# Altium schematic sheet STM32最小系统.SchDoc
size A3
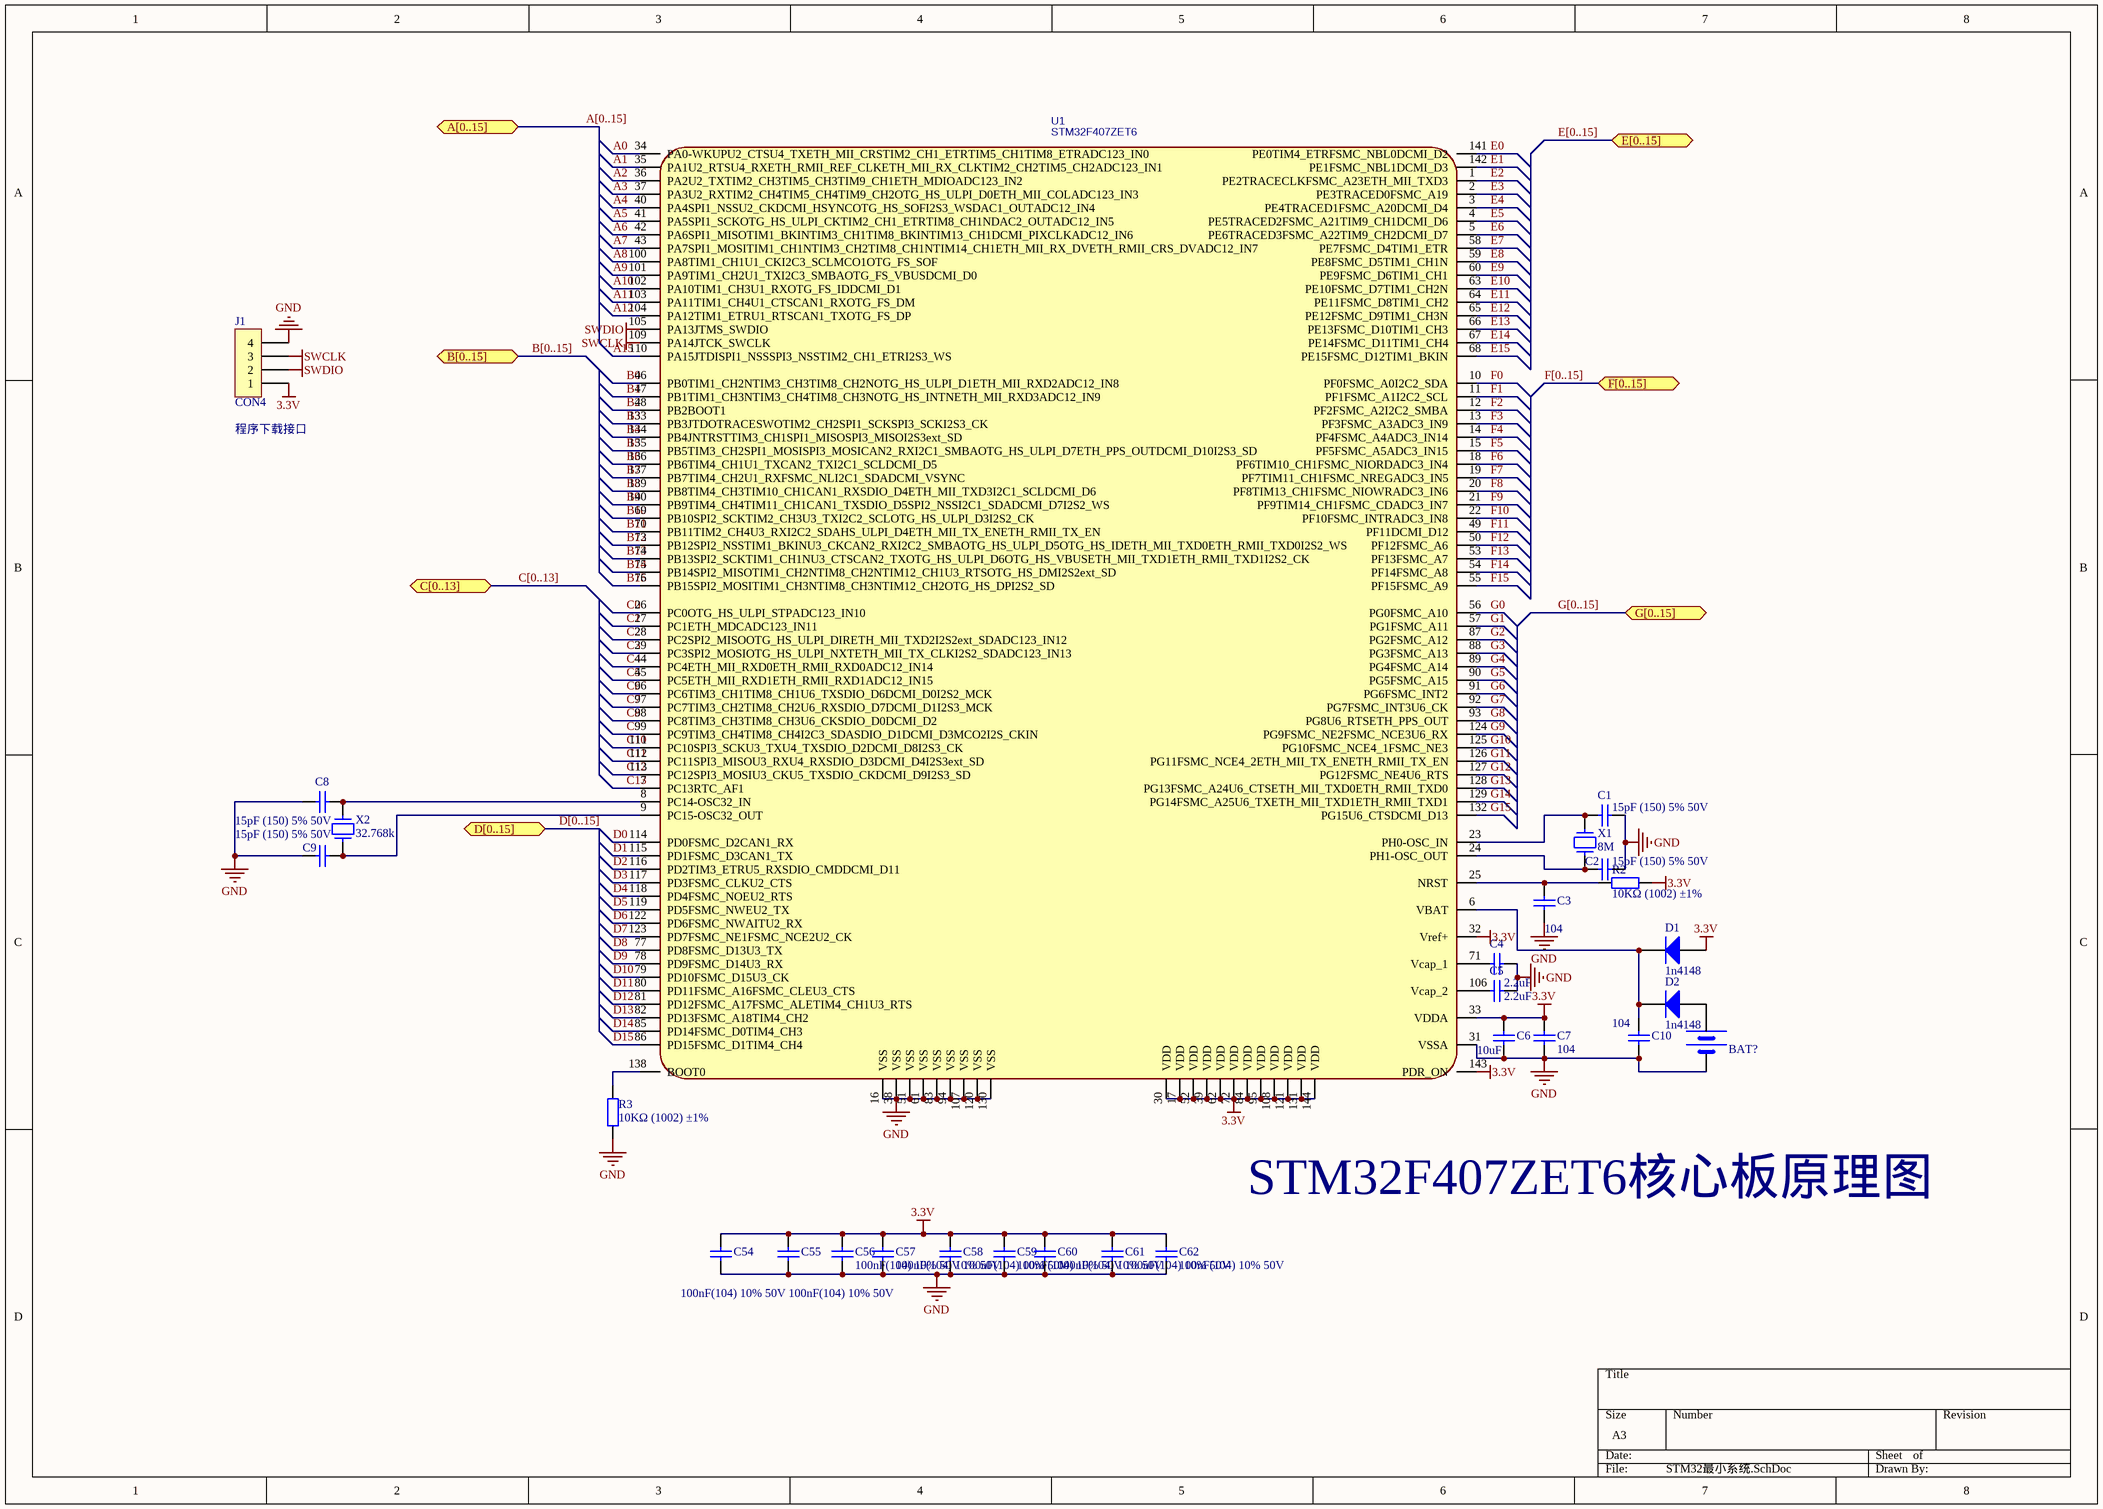
[diagram p0: STM32最小系统.SchDoc]

## Parts
BAT?  BATT  [BATM]  (value not drawn)
C1  15pF (150) 5% 50V  [0805_C]
C2  15pF (150) 5% 50V  [0805_C]
C3  104  [0805_C]
C4  2.2uF  [0805_C]
C5  2.2uF  [0805_C]
C6  10uF  [0805_C]
C7  104  [0805_C]
C8  15pF (150) 5% 50V  [0805_C]
C9  15pF (150) 5% 50V  [0805_C]
C10  104  [0805_C]
C54  100nF(104) 10% 50V  [0805_C]
C55  100nF(104) 10% 50V  [0805_C]
C56  100nF(104) 10% 50V  [0805_C]
C57  100nF(104) 10% 50V  [0805_C]
C58  100nF(104) 10% 50V  [0805_C]
C59  100nF(104) 10% 50V  [0805_C]
C60  100nF(104) 10% 50V  [0805_C]
C61  100nF(104) 10% 50V  [0805_C]
C62  100nF(104) 10% 50V  [0805_C]
D1  1n4148  [SOD-123]
D2  1n4148  [SOD-123]
J1  CON4  [XH2.54-4P]
R2  10KΩ (1002) ±1%  [0805_R]
R3  10KΩ (1002) ±1%  [0805_R]
U1  STM32F407ZET6  [QFP-144-0.5]
X1  8M  [HC49S]
X2  32.768k  [HC49S]

## Ports
A[0..15], B[0..15], C[0..13], D[0..15], E[0..15], F[0..15], G[0..15]

## Nets
3.3V: C6.2 C7.2 C54.2 C55.2 C56.2 C57.2 C58.2 C59.2 C60.2 C61.2 C62.2 D1.1(A) J1.1 R2.1 U1.17(VDD) U1.30(VDD) U1.32(Vref+) U1.33(VDDA) U1.39(VDD) U1.52(VDD) U1.62(VDD) U1.72(VDD) U1.84(VDD) U1.95(VDD) U1.108(VDD) U1.121(VDD) U1.131(VDD) U1.143(PDR_ON) U1.144(VDD)
GND: BAT?.2(GND) C1.2 C2.2 C3.1 C4.2 C5.2 C6.1 C7.1 C8.1 C9.1 C10.1 C54.1 C55.1 C56.1 C57.1 C58.1 C59.1 C60.1 C61.1 C62.1 J1.4 R3.1 U1.16(VSS) U1.31(VSSA) U1.38(VSS) U1.51(VSS) U1.61(VSS) U1.83(VSS) U1.94(VSS) U1.107(VSS) U1.120(VSS) U1.130(VSS)
SWCLK: J1.3 U1.109(PA14JTCK_SWCLK)
SWDIO: J1.2 U1.105(PA13JTMS_SWDIO)
A0: U1.34(PA0-WKUPU2_CTSU4_TXETH_MII_CRSTIM2_CH1_ETRTIM5_CH1TIM8_ETRADC123_IN0)
A1: U1.35(PA1U2_RTSU4_RXETH_RMII_REF_CLKETH_MII_RX_CLKTIM2_CH2TIM5_CH2ADC123_IN1)
A2: U1.36(PA2U2_TXTIM2_CH3TIM5_CH3TIM9_CH1ETH_MDIOADC123_IN2)
A3: U1.37(PA3U2_RXTIM2_CH4TIM5_CH4TIM9_CH2OTG_HS_ULPI_D0ETH_MII_COLADC123_IN3)
A4: U1.40(PA4SPI1_NSSU2_CKDCMI_HSYNCOTG_HS_SOFI2S3_WSDAC1_OUTADC12_IN4)
A5: U1.41(PA5SPI1_SCKOTG_HS_ULPI_CKTIM2_CH1_ETRTIM8_CH1NDAC2_OUTADC12_IN5)
A6: U1.42(PA6SPI1_MISOTIM1_BKINTIM3_CH1TIM8_BKINTIM13_CH1DCMI_PIXCLKADC12_IN6)
A7: U1.43(PA7SPI1_MOSITIM1_CH1NTIM3_CH2TIM8_CH1NTIM14_CH1ETH_MII_RX_DVETH_RMII_CRS_DVADC12_IN7)
A8: U1.100(PA8TIM1_CH1U1_CKI2C3_SCLMCO1OTG_FS_SOF)
A9: U1.101(PA9TIM1_CH2U1_TXI2C3_SMBAOTG_FS_VBUSDCMI_D0)
A10: U1.102(PA10TIM1_CH3U1_RXOTG_FS_IDDCMI_D1)
A11: U1.103(PA11TIM1_CH4U1_CTSCAN1_RXOTG_FS_DM)
A12: U1.104(PA12TIM1_ETRU1_RTSCAN1_TXOTG_FS_DP)
A15: U1.110(PA15JTDISPI1_NSSSPI3_NSSTIM2_CH1_ETRI2S3_WS)
B0: U1.46(PB0TIM1_CH2NTIM3_CH3TIM8_CH2NOTG_HS_ULPI_D1ETH_MII_RXD2ADC12_IN8)
B1: U1.47(PB1TIM1_CH3NTIM3_CH4TIM8_CH3NOTG_HS_INTNETH_MII_RXD3ADC12_IN9)
B2: U1.48(PB2BOOT1)
B3: U1.133(PB3JTDOTRACESWOTIM2_CH2SPI1_SCKSPI3_SCKI2S3_CK)
B4: U1.134(PB4JNTRSTTIM3_CH1SPI1_MISOSPI3_MISOI2S3ext_SD)
B5: U1.135(PB5TIM3_CH2SPI1_MOSISPI3_MOSICAN2_RXI2C1_SMBAOTG_HS_ULPI_D7ETH_PPS_OUTDCMI_D10I2S3_SD)
B6: U1.136(PB6TIM4_CH1U1_TXCAN2_TXI2C1_SCLDCMI_D5)
B7: U1.137(PB7TIM4_CH2U1_RXFSMC_NLI2C1_SDADCMI_VSYNC)
B8: U1.139(PB8TIM4_CH3TIM10_CH1CAN1_RXSDIO_D4ETH_MII_TXD3I2C1_SCLDCMI_D6)
B9: U1.140(PB9TIM4_CH4TIM11_CH1CAN1_TXSDIO_D5SPI2_NSSI2C1_SDADCMI_D7I2S2_WS)
B10: U1.69(PB10SPI2_SCKTIM2_CH3U3_TXI2C2_SCLOTG_HS_ULPI_D3I2S2_CK)
B11: U1.70(PB11TIM2_CH4U3_RXI2C2_SDAHS_ULPI_D4ETH_MII_TX_ENETH_RMII_TX_EN)
B12: U1.73(PB12SPI2_NSSTIM1_BKINU3_CKCAN2_RXI2C2_SMBAOTG_HS_ULPI_D5OTG_HS_IDETH_MII_TXD0ETH_RMII_TXD0I2S2_WS)
B13: U1.74(PB13SPI2_SCKTIM1_CH1NU3_CTSCAN2_TXOTG_HS_ULPI_D6OTG_HS_VBUSETH_MII_TXD1ETH_RMII_TXD1I2S2_CK)
B14: U1.75(PB14SPI2_MISOTIM1_CH2NTIM8_CH2NTIM12_CH1U3_RTSOTG_HS_DMI2S2ext_SD)
B15: U1.76(PB15SPI2_MOSITIM1_CH3NTIM8_CH3NTIM12_CH2OTG_HS_DPI2S2_SD)
C0: U1.26(PC0OTG_HS_ULPI_STPADC123_IN10)
C1: U1.27(PC1ETH_MDCADC123_IN11)
C2: U1.28(PC2SPI2_MISOOTG_HS_ULPI_DIRETH_MII_TXD2I2S2ext_SDADC123_IN12)
C3: U1.29(PC3SPI2_MOSIOTG_HS_ULPI_NXTETH_MII_TX_CLKI2S2_SDADC123_IN13)
C4: U1.44(PC4ETH_MII_RXD0ETH_RMII_RXD0ADC12_IN14)
C5: U1.45(PC5ETH_MII_RXD1ETH_RMII_RXD1ADC12_IN15)
C6: U1.96(PC6TIM3_CH1TIM8_CH1U6_TXSDIO_D6DCMI_D0I2S2_MCK)
C7: U1.97(PC7TIM3_CH2TIM8_CH2U6_RXSDIO_D7DCMI_D1I2S3_MCK)
C8: U1.98(PC8TIM3_CH3TIM8_CH3U6_CKSDIO_D0DCMI_D2)
C9: U1.99(PC9TIM3_CH4TIM8_CH4I2C3_SDASDIO_D1DCMI_D3MCO2I2S_CKIN)
C10: U1.111(PC10SPI3_SCKU3_TXU4_TXSDIO_D2DCMI_D8I2S3_CK)
C11: U1.112(PC11SPI3_MISOU3_RXU4_RXSDIO_D3DCMI_D4I2S3ext_SD)
C12: U1.113(PC12SPI3_MOSIU3_CKU5_TXSDIO_CKDCMI_D9I2S3_SD)
C13: U1.7(PC13RTC_AF1)
D0: U1.114(PD0FSMC_D2CAN1_RX)
D1: U1.115(PD1FSMC_D3CAN1_TX)
D2: U1.116(PD2TIM3_ETRU5_RXSDIO_CMDDCMI_D11)
D3: U1.117(PD3FSMC_CLKU2_CTS)
D4: U1.118(PD4FSMC_NOEU2_RTS)
D5: U1.119(PD5FSMC_NWEU2_TX)
D6: U1.122(PD6FSMC_NWAITU2_RX)
D7: U1.123(PD7FSMC_NE1FSMC_NCE2U2_CK)
D8: U1.77(PD8FSMC_D13U3_TX)
D9: U1.78(PD9FSMC_D14U3_RX)
D10: U1.79(PD10FSMC_D15U3_CK)
D11: U1.80(PD11FSMC_A16FSMC_CLEU3_CTS)
D12: U1.81(PD12FSMC_A17FSMC_ALETIM4_CH1U3_RTS)
D13: U1.82(PD13FSMC_A18TIM4_CH2)
D14: U1.85(PD14FSMC_D0TIM4_CH3)
D15: U1.86(PD15FSMC_D1TIM4_CH4)
E0: U1.141(PE0TIM4_ETRFSMC_NBL0DCMI_D2)
E1: U1.142(PE1FSMC_NBL1DCMI_D3)
E2: U1.1(PE2TRACECLKFSMC_A23ETH_MII_TXD3)
E3: U1.2(PE3TRACED0FSMC_A19)
E4: U1.3(PE4TRACED1FSMC_A20DCMI_D4)
E5: U1.4(PE5TRACED2FSMC_A21TIM9_CH1DCMI_D6)
E6: U1.5(PE6TRACED3FSMC_A22TIM9_CH2DCMI_D7)
E7: U1.58(PE7FSMC_D4TIM1_ETR)
E8: U1.59(PE8FSMC_D5TIM1_CH1N)
E9: U1.60(PE9FSMC_D6TIM1_CH1)
E10: U1.63(PE10FSMC_D7TIM1_CH2N)
E11: U1.64(PE11FSMC_D8TIM1_CH2)
E12: U1.65(PE12FSMC_D9TIM1_CH3N)
E13: U1.66(PE13FSMC_D10TIM1_CH3)
E14: U1.67(PE14FSMC_D11TIM1_CH4)
E15: U1.68(PE15FSMC_D12TIM1_BKIN)
F0: U1.10(PF0FSMC_A0I2C2_SDA)
F1: U1.11(PF1FSMC_A1I2C2_SCL)
F2: U1.12(PF2FSMC_A2I2C2_SMBA)
F3: U1.13(PF3FSMC_A3ADC3_IN9)
F4: U1.14(PF4FSMC_A4ADC3_IN14)
F5: U1.15(PF5FSMC_A5ADC3_IN15)
F6: U1.18(PF6TIM10_CH1FSMC_NIORDADC3_IN4)
F7: U1.19(PF7TIM11_CH1FSMC_NREGADC3_IN5)
F8: U1.20(PF8TIM13_CH1FSMC_NIOWRADC3_IN6)
F9: U1.21(PF9TIM14_CH1FSMC_CDADC3_IN7)
F10: U1.22(PF10FSMC_INTRADC3_IN8)
F11: U1.49(PF11DCMI_D12)
F12: U1.50(PF12FSMC_A6)
F13: U1.53(PF13FSMC_A7)
F14: U1.54(PF14FSMC_A8)
F15: U1.55(PF15FSMC_A9)
G0: U1.56(PG0FSMC_A10)
G1: U1.57(PG1FSMC_A11)
G2: U1.87(PG2FSMC_A12)
G3: U1.88(PG3FSMC_A13)
G4: U1.89(PG4FSMC_A14)
G5: U1.90(PG5FSMC_A15)
G6: U1.91(PG6FSMC_INT2)
G7: U1.92(PG7FSMC_INT3U6_CK)
G8: U1.93(PG8U6_RTSETH_PPS_OUT)
G9: U1.124(PG9FSMC_NE2FSMC_NCE3U6_RX)
G10: U1.125(PG10FSMC_NCE4_1FSMC_NE3)
G11: U1.126(PG11FSMC_NCE4_2ETH_MII_TX_ENETH_RMII_TX_EN)
G12: U1.127(PG12FSMC_NE4U6_RTS)
G13: U1.128(PG13FSMC_A24U6_CTSETH_MII_TXD0ETH_RMII_TXD0)
G14: U1.129(PG14FSMC_A25U6_TXETH_MII_TXD1ETH_RMII_TXD1)
G15: U1.132(PG15U6_CTSDCMI_D13)
NetBAT?_1: BAT?.1(VCC) D2.1(A)
NetC1_1: C1.1 U1.23(PH0-OSC_IN) X1.1
NetC2_1: C2.1 U1.24(PH1-OSC_OUT) X1.2
NetC3_2: C3.2 R2.2 U1.25(NRST)
NetC4_1: C4.1 U1.71(Vcap_1)
NetC5_1: C5.1 U1.106(Vcap_2)
NetC8_2: C8.2 U1.8(PC14-OSC32_IN) X2.1
NetC9_2: C9.2 U1.9(PC15-OSC32_OUT) X2.2
NetC10_2: C10.2 D1.2(K) D2.2(K) U1.6(VBAT)
NetR3_2: R3.2 U1.138(BOOT0)

## Buses and harness runs
bus A[0..15] = port A[0..15]
bus B[0..15] = port B[0..15]
bus C[0..13] = port C[0..13]
bus D[0..15] = port D[0..15]
bus E[0..15] = port E[0..15]
bus F[0..15] = port F[0..15]
bus G[0..15] = port G[0..15]

## Notes on the sheet
- (near J1) 程序下载接口
- STM32F407ZET6核心板原理图

## Library data of the parts
BAT? = BAT
C1 C2 C8 C9 = 0805 15pF (150) 5% 50V: 贴片电容; ComponentLink1Description: 供应商链接; ComponentLink1URL: http://www.szlcsc.com/product/details_2146.html; Package: 0805; Supplier: LC; SuppliersPartNumber: C1794
C3 C7 C10 C54-C62 = 0805 100nF(104) 10% 50V: 贴片电容; ComponentLink1Description: 供应商链接; ComponentLink1URL: http://www.szlcsc.com/product/details_50686.html; Package: 0805; Supplier: LC; SuppliersPartNumber: C49678
C4 C5 = 0805 2.2uF (225) 20% 50V: 贴片电容; ComponentLink1Description: 供应商链接; ComponentLink1URL: http://www.szlcsc.com/product/details_50225.html; Package: 0805; Supplier: LC; SuppliersPartNumber: C49217
C6 = 0805 10uF (106) 10% 25V: 贴片电容; ComponentLink1Description: 供应商链接; ComponentLink1URL: http://www.szlcsc.com/product/details_16532.html; Package: 0805; Supplier: LC; SuppliersPartNumber: C15850
D1 D2 = SOD-123 B5819W  SL: 肖特基二极管; ComponentLink1Description: 供应商链接; ComponentLink1URL: http://www.szlcsc.com/product/details_9093.html; Package: SOD-123; Supplier: LC; SuppliersPartNumber: C8598
J1 = CON4: 连接器
R2 R3 = 0805 10KΩ (1002) 1%: 贴片电阻; ComponentLink1Description: 供应商链接; ComponentLink1URL: http://www.szlcsc.com/product/details_18102.html; Package: 0805; Supplier: LC; SuppliersPartNumber: C17414
U1 = STM32F407ZET6: Contributor: zheteng1996; timeStamp: 1467457557; spicePre: U; spiceSymbolName: STM32F407ZET6
X1 X2 = XTAL-2: Crystal